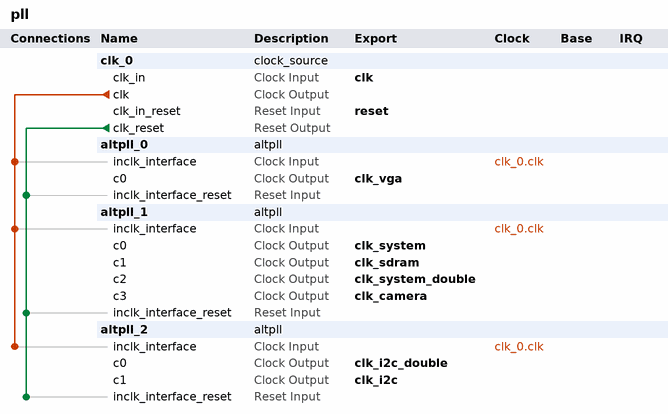
[diagram p0: system contents]
# Platform Designer (Qsys) system pll, Cyclone IV E EP4CE115F29C7
# Parameters at their usual value, and those the tool derives, are not listed.
package require -exact qsys 20.1
create_system pll
set_project_property DEVICE_FAMILY {Cyclone IV E}
set_project_property DEVICE EP4CE115F29C7

add_instance clk_0 clock_source 20.1
set_instance_parameter_value clk_0 clockFrequency 50000000

add_instance altpll_0 altpll 20.1
set_instance_parameter_value altpll_0 CLK0_DIVIDE_BY 2000
set_instance_parameter_value altpll_0 CLK0_MULTIPLY_BY 1007
set_instance_parameter_value altpll_0 INCLK0_INPUT_FREQUENCY 20000
set_instance_parameter_value altpll_0 PORT_ARESET PORT_USED
set_instance_parameter_value altpll_0 PORT_LOCKED PORT_USED
set_instance_parameter_value altpll_0 PORT_clk1 PORT_UNUSED
set_instance_parameter_value altpll_0 PORT_clk2 PORT_UNUSED
set_instance_parameter_value altpll_0 PORT_clk3 PORT_UNUSED

add_instance altpll_1 altpll 20.1
set_instance_parameter_value altpll_1 CLK0_DIVIDE_BY 5
set_instance_parameter_value altpll_1 CLK0_MULTIPLY_BY 9
set_instance_parameter_value altpll_1 CLK1_DIVIDE_BY 5
set_instance_parameter_value altpll_1 CLK1_DUTY_CYCLE 50
set_instance_parameter_value altpll_1 CLK1_MULTIPLY_BY 9
set_instance_parameter_value altpll_1 CLK1_PHASE_SHIFT -3000
set_instance_parameter_value altpll_1 CLK2_DIVIDE_BY 5
set_instance_parameter_value altpll_1 CLK2_DUTY_CYCLE 50
set_instance_parameter_value altpll_1 CLK2_MULTIPLY_BY 18
set_instance_parameter_value altpll_1 CLK2_PHASE_SHIFT 0
set_instance_parameter_value altpll_1 CLK3_DIVIDE_BY 2
set_instance_parameter_value altpll_1 CLK3_DUTY_CYCLE 50
set_instance_parameter_value altpll_1 CLK3_MULTIPLY_BY 1
set_instance_parameter_value altpll_1 CLK3_PHASE_SHIFT 0
set_instance_parameter_value altpll_1 COMPENSATE_CLOCK CLK1
set_instance_parameter_value altpll_1 INCLK0_INPUT_FREQUENCY 20000
set_instance_parameter_value altpll_1 OPERATION_MODE ZERO_DELAY_BUFFER
set_instance_parameter_value altpll_1 PORT_ARESET PORT_USED
set_instance_parameter_value altpll_1 PORT_LOCKED PORT_USED
set_instance_parameter_value altpll_1 PORT_clk1 PORT_USED
set_instance_parameter_value altpll_1 PORT_clk2 PORT_USED
set_instance_parameter_value altpll_1 PORT_clk3 PORT_USED

add_instance altpll_2 altpll 20.1
set_instance_parameter_value altpll_2 CLK0_DIVIDE_BY 1250
set_instance_parameter_value altpll_2 CLK0_MULTIPLY_BY 1
set_instance_parameter_value altpll_2 CLK1_DIVIDE_BY 2500
set_instance_parameter_value altpll_2 CLK1_DUTY_CYCLE 50
set_instance_parameter_value altpll_2 CLK1_MULTIPLY_BY 1
set_instance_parameter_value altpll_2 CLK1_PHASE_SHIFT 0
set_instance_parameter_value altpll_2 INCLK0_INPUT_FREQUENCY 20000
set_instance_parameter_value altpll_2 PORT_ARESET PORT_USED
set_instance_parameter_value altpll_2 PORT_LOCKED PORT_USED
set_instance_parameter_value altpll_2 PORT_clk1 PORT_USED
set_instance_parameter_value altpll_2 PORT_clk2 PORT_UNUSED
set_instance_parameter_value altpll_2 PORT_clk3 PORT_UNUSED

# connections
add_connection clk_0.clk altpll_0.inclk_interface clock
add_connection clk_0.clk altpll_1.inclk_interface clock
add_connection clk_0.clk altpll_2.inclk_interface clock
add_connection clk_0.clk_reset altpll_0.inclk_interface_reset reset
add_connection clk_0.clk_reset altpll_1.inclk_interface_reset reset
add_connection clk_0.clk_reset altpll_2.inclk_interface_reset reset

# exported interfaces
add_interface clk clock sink
set_interface_property clk EXPORT_OF clk_0.clk_in
add_interface clk_camera clock source
set_interface_property clk_camera EXPORT_OF altpll_1.c3
add_interface clk_i2c clock source
set_interface_property clk_i2c EXPORT_OF altpll_2.c1
add_interface clk_i2c_double clock source
set_interface_property clk_i2c_double EXPORT_OF altpll_2.c0
add_interface clk_sdram clock source
set_interface_property clk_sdram EXPORT_OF altpll_1.c1
add_interface clk_system clock source
set_interface_property clk_system EXPORT_OF altpll_1.c0
add_interface clk_system_double clock source
set_interface_property clk_system_double EXPORT_OF altpll_1.c2
add_interface clk_vga clock source
set_interface_property clk_vga EXPORT_OF altpll_0.c0
add_interface reset reset sink
set_interface_property reset EXPORT_OF clk_0.clk_in_reset

set_interconnect_requirement {$system} qsys_mm.clockCrossingAdapter HANDSHAKE
set_interconnect_requirement {$system} qsys_mm.enableEccProtection FALSE
set_interconnect_requirement {$system} qsys_mm.insertDefaultSlave FALSE
set_interconnect_requirement {$system} qsys_mm.maxAdditionalLatency 1

save_system pll.qsys
